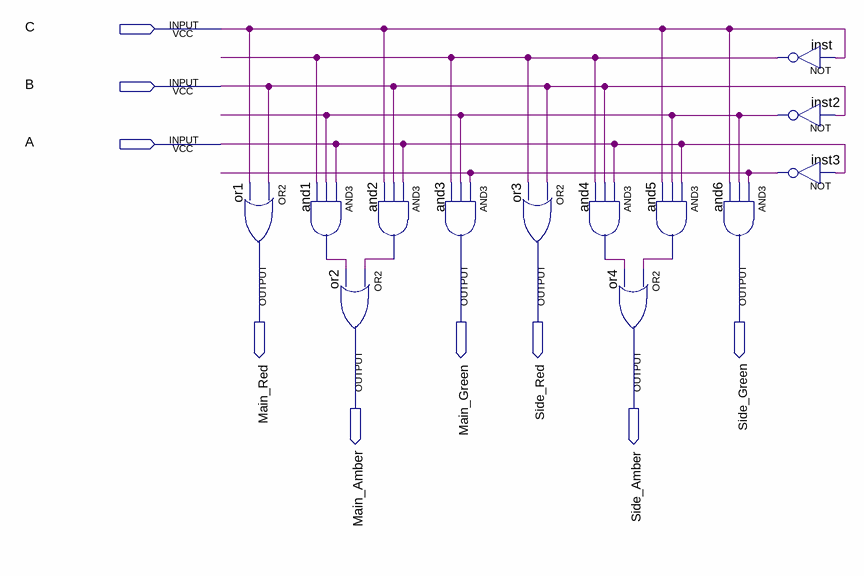
[diagram p0: schematic sheet]
// Quartus schematic LightDecoder.bdf as structural Verilog: 13 symbols, 9 pins
module LightDecoder (
  input  C,
  input  B,
  input  A,
  output Main_Red,
  output Main_Green,
  output Side_Red,
  output Side_Green,
  output Main_Amber,
  output Side_Amber
);

  wire and1_out, and2_out, and4_out, and5_out, inst2_out, inst3_out, inst_out;

  or or1 (Main_Red, B, C);
  and and1 (and1_out, A, inst2_out, inst_out);
  and and2 (and2_out, A, B, C);
  or or2 (Main_Amber, and2_out, and1_out);
  and and3 (Main_Green, inst3_out, inst2_out, inst_out);
  or or3 (Side_Red, B, inst_out);
  and and4 (and4_out, A, B, inst_out);
  or or4 (Side_Amber, and5_out, and4_out);
  and and5 (and5_out, A, inst2_out, C);
  and and6 (Side_Green, inst3_out, inst2_out, C);
  not inst (inst_out, C);
  not inst2 (inst2_out, B);
  not inst3 (inst3_out, A);
endmodule
